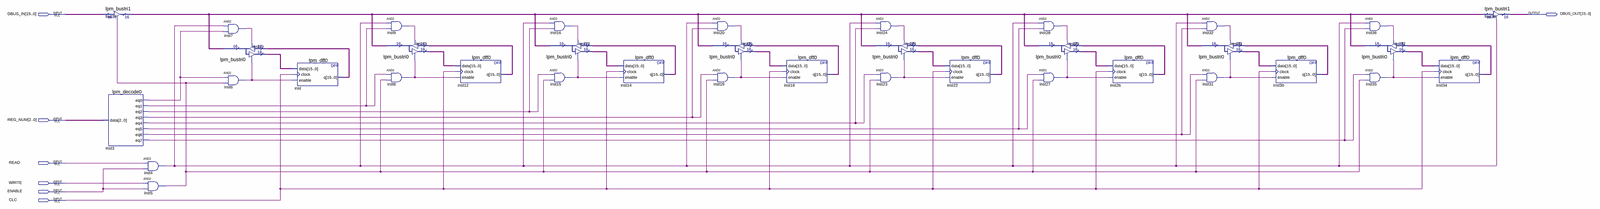
[diagram p0: schematic sheet, whole]
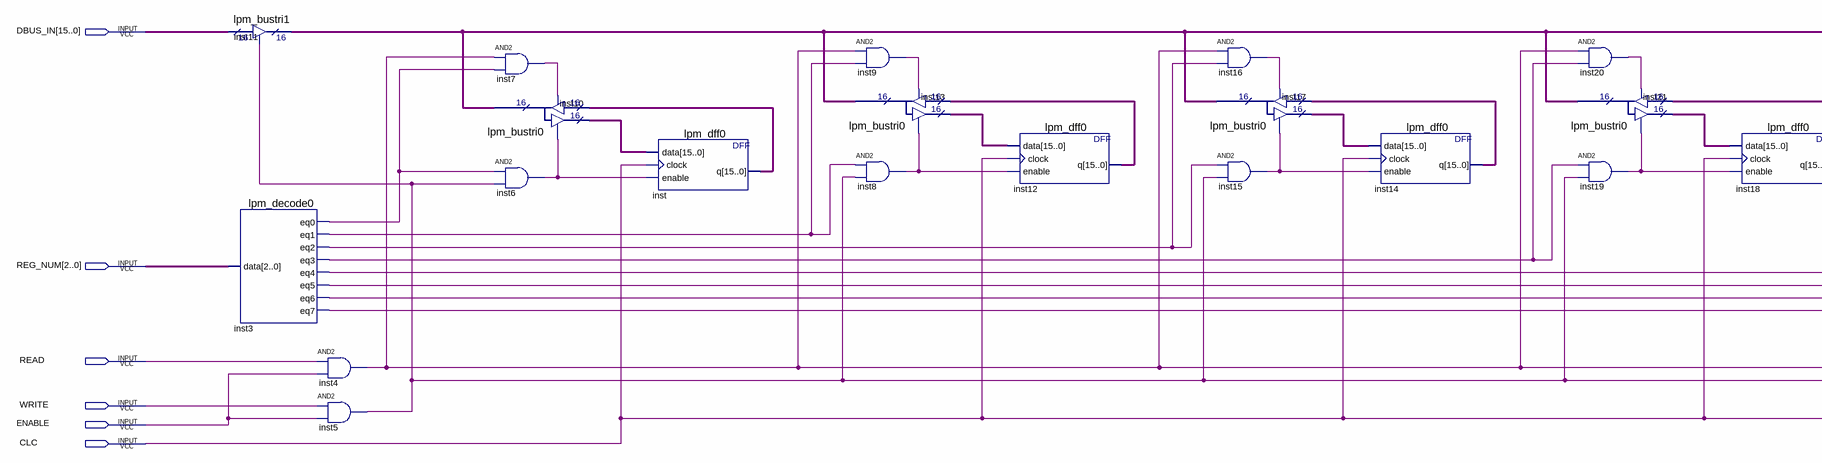
[diagram p1: schematic sheet, left part]
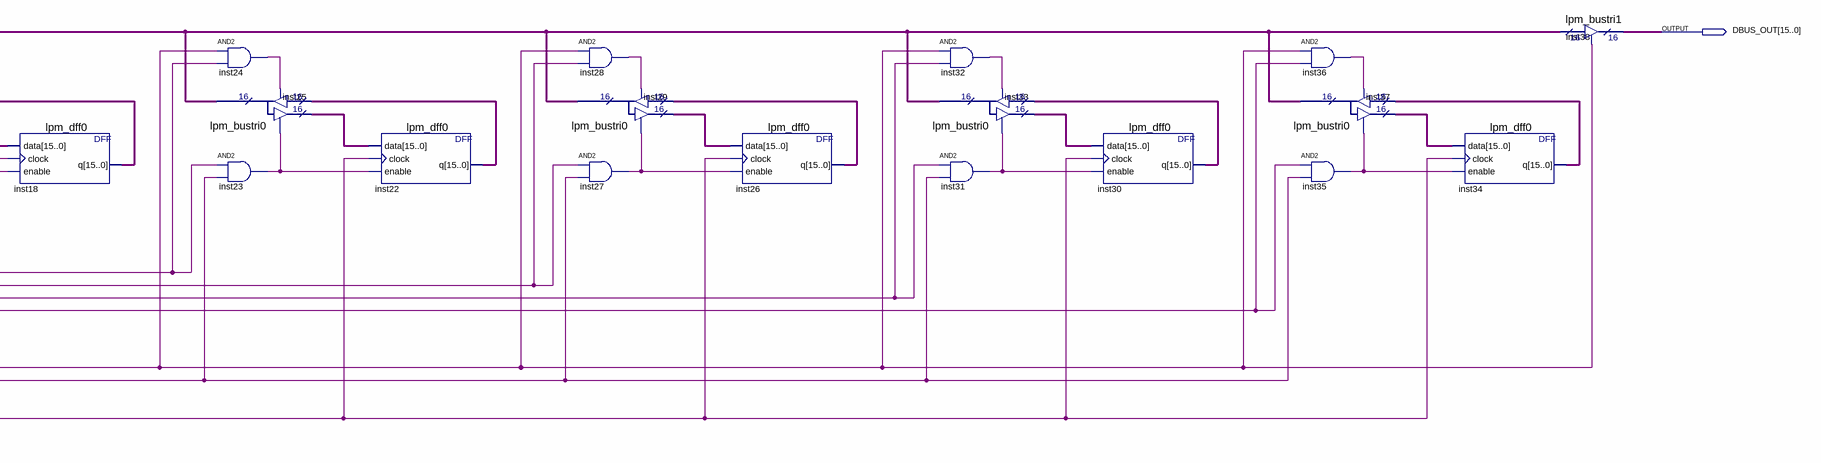
[diagram p2: schematic sheet, right part]
// Quartus schematic Registers.bdf as structural Verilog: 37 symbols, 7 pins
module Registers (
  input  [15:0] DBUS_IN,
  input  [2:0] REG_NUM,
  input  READ,
  input  WRITE,
  input  ENABLE,
  input  CLC,
  output [15:0] DBUS_OUT
);

  wire inst3_eq0, inst3_eq1, inst3_eq2, inst3_eq3, inst3_eq4, inst3_eq5, inst3_eq6, inst3_eq7, inst4_out,
       inst5_out, inst6_out, inst7_out, inst8_out, inst9_out, inst15_out, inst16_out, inst19_out, inst20_out,
       inst23_out, inst24_out, inst27_out, inst28_out, inst31_out, inst32_out, inst35_out, inst36_out;
  wire [15:0] inst10_result, inst11_tridata, inst12_q, inst13_result, inst14_q, inst17_result, inst18_q,
       inst21_result, inst22_q, inst25_result, inst26_q, inst29_result, inst30_q, inst33_result, inst34_q,
       inst37_result, inst_q;

  lpm_bustri1 inst11 (.enabledt(inst5_out), .data(DBUS_IN), .tridata(inst11_tridata));
  lpm_decode0 inst3 (
    .data(REG_NUM), .eq0(inst3_eq0), .eq1(inst3_eq1), .eq2(inst3_eq2), .eq3(inst3_eq3), .eq4(inst3_eq4),
    .eq5(inst3_eq5), .eq6(inst3_eq6), .eq7(inst3_eq7));
  and inst4 (inst4_out, READ, ENABLE);
  and inst5 (inst5_out, WRITE, ENABLE);
  and inst7 (inst7_out, inst4_out, inst3_eq0);
  lpm_bustri0 inst10 (
    .enabledt(inst7_out), .data(inst_q), .enabletr(inst6_out), .result(inst10_result),
    .tridata(inst11_tridata));
  and inst6 (inst6_out, inst3_eq0, inst5_out);
  lpm_dff0 inst (.data(inst10_result), .clock(CLC), .enable(inst6_out), .q(inst_q));
  and inst9 (inst9_out, inst4_out, inst3_eq1);
  lpm_bustri0 inst13 (
    .enabledt(inst9_out), .data(inst12_q), .enabletr(inst8_out), .result(inst13_result),
    .tridata(inst11_tridata));
  and inst8 (inst8_out, inst3_eq1, inst5_out);
  lpm_dff0 inst12 (.data(inst13_result), .clock(CLC), .enable(inst8_out), .q(inst12_q));
  and inst16 (inst16_out, inst4_out, inst3_eq2);
  lpm_bustri0 inst17 (
    .enabledt(inst16_out), .data(inst14_q), .enabletr(inst15_out), .result(inst17_result),
    .tridata(inst11_tridata));
  and inst15 (inst15_out, inst3_eq2, inst5_out);
  lpm_dff0 inst14 (.data(inst17_result), .clock(CLC), .enable(inst15_out), .q(inst14_q));
  and inst20 (inst20_out, inst4_out, inst3_eq3);
  lpm_bustri0 inst21 (
    .enabledt(inst20_out), .data(inst18_q), .enabletr(inst19_out), .result(inst21_result),
    .tridata(inst11_tridata));
  and inst19 (inst19_out, inst3_eq3, inst5_out);
  lpm_dff0 inst18 (.data(inst21_result), .clock(CLC), .enable(inst19_out), .q(inst18_q));
  and inst24 (inst24_out, inst4_out, inst3_eq4);
  lpm_bustri0 inst25 (
    .enabledt(inst24_out), .data(inst22_q), .enabletr(inst23_out), .result(inst25_result),
    .tridata(inst11_tridata));
  and inst23 (inst23_out, inst3_eq4, inst5_out);
  lpm_dff0 inst22 (.data(inst25_result), .clock(CLC), .enable(inst23_out), .q(inst22_q));
  and inst28 (inst28_out, inst4_out, inst3_eq5);
  lpm_bustri0 inst29 (
    .enabledt(inst28_out), .data(inst26_q), .enabletr(inst27_out), .result(inst29_result),
    .tridata(inst11_tridata));
  and inst27 (inst27_out, inst3_eq5, inst5_out);
  lpm_dff0 inst26 (.data(inst29_result), .clock(CLC), .enable(inst27_out), .q(inst26_q));
  and inst32 (inst32_out, inst4_out, inst3_eq6);
  lpm_bustri0 inst33 (
    .enabledt(inst32_out), .data(inst30_q), .enabletr(inst31_out), .result(inst33_result),
    .tridata(inst11_tridata));
  and inst31 (inst31_out, inst3_eq6, inst5_out);
  lpm_dff0 inst30 (.data(inst33_result), .clock(CLC), .enable(inst31_out), .q(inst30_q));
  and inst36 (inst36_out, inst4_out, inst3_eq7);
  lpm_bustri0 inst37 (
    .enabledt(inst36_out), .data(inst34_q), .enabletr(inst35_out), .result(inst37_result),
    .tridata(inst11_tridata));
  and inst35 (inst35_out, inst3_eq7, inst5_out);
  lpm_dff0 inst34 (.data(inst37_result), .clock(CLC), .enable(inst35_out), .q(inst34_q));
  lpm_bustri1 inst38 (.enabledt(inst4_out), .data(inst11_tridata), .tridata(DBUS_OUT));
endmodule
